# EasyEDA Pro project ProDoc_AstrAlim_2025-03-20.epro, board AstrAlim PCB
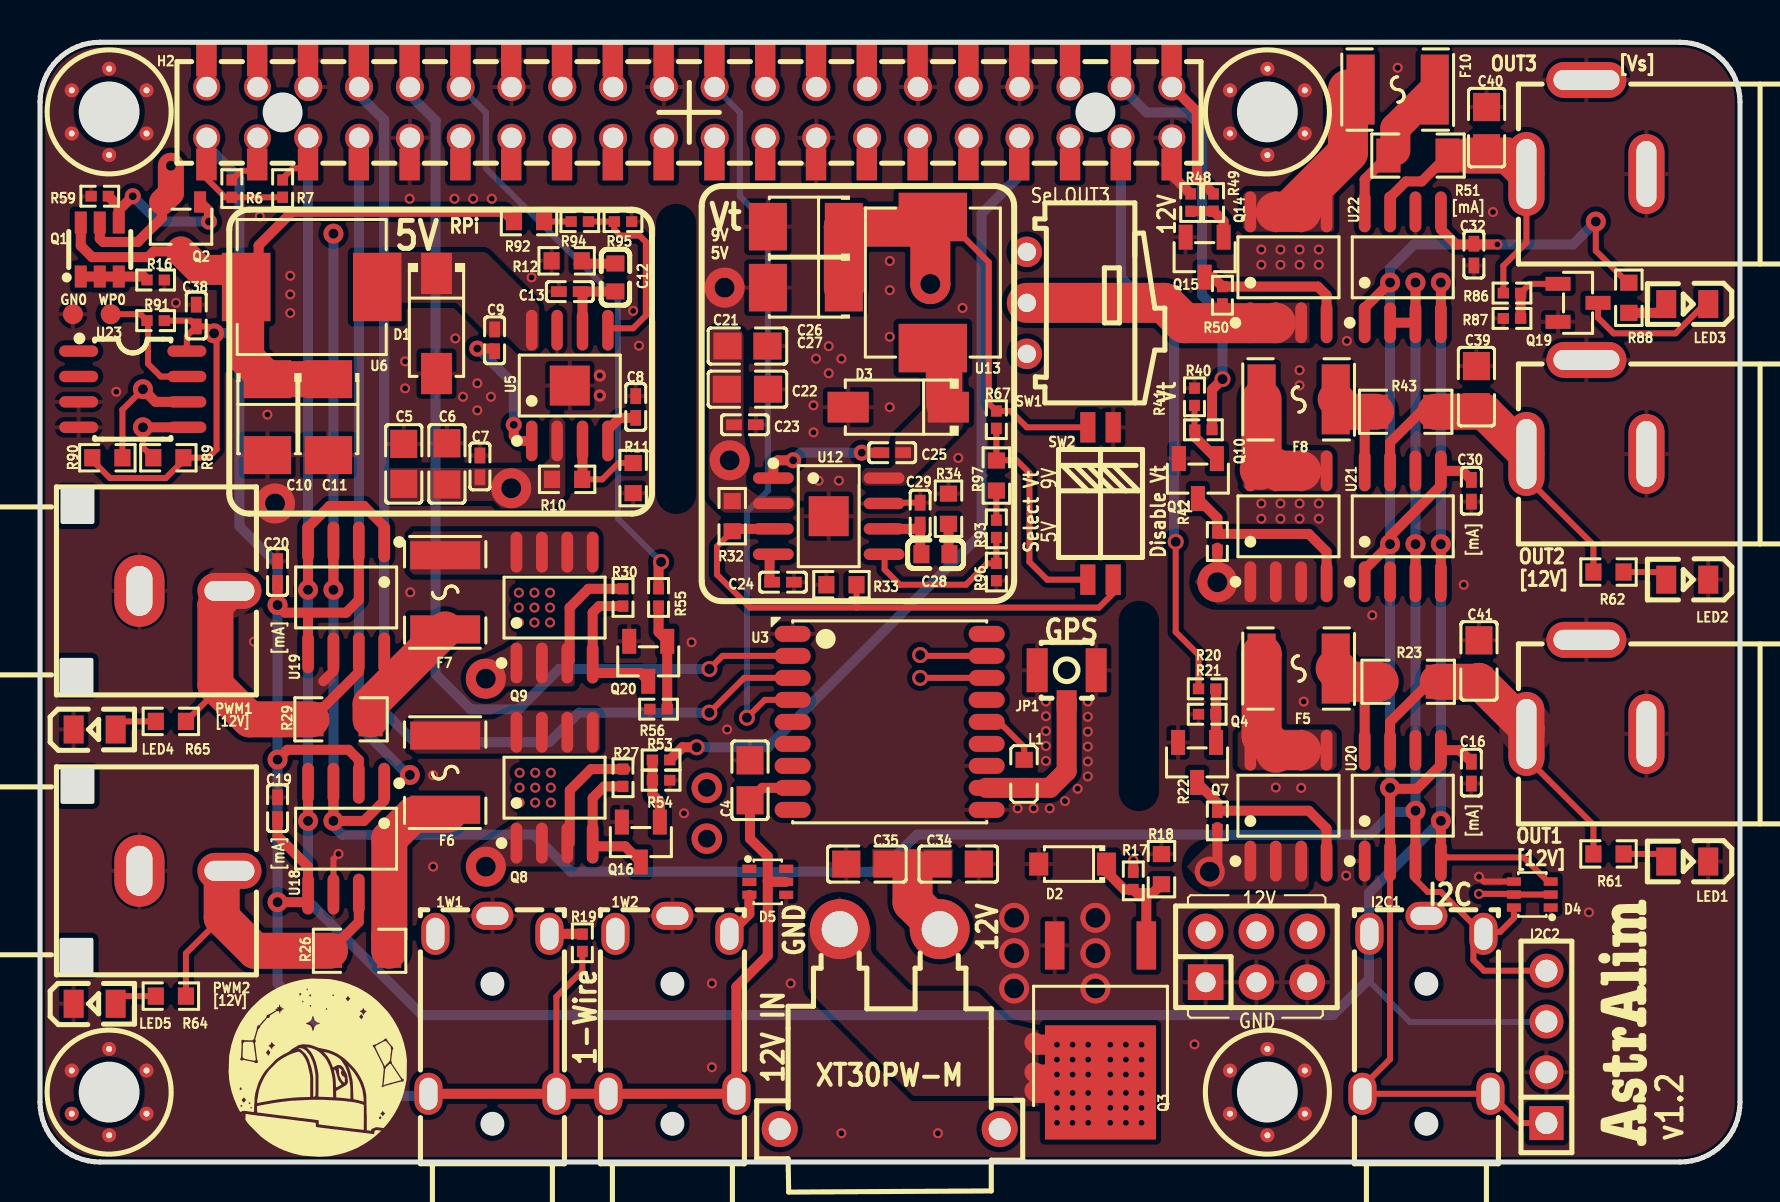
[diagram p2: board, top side]
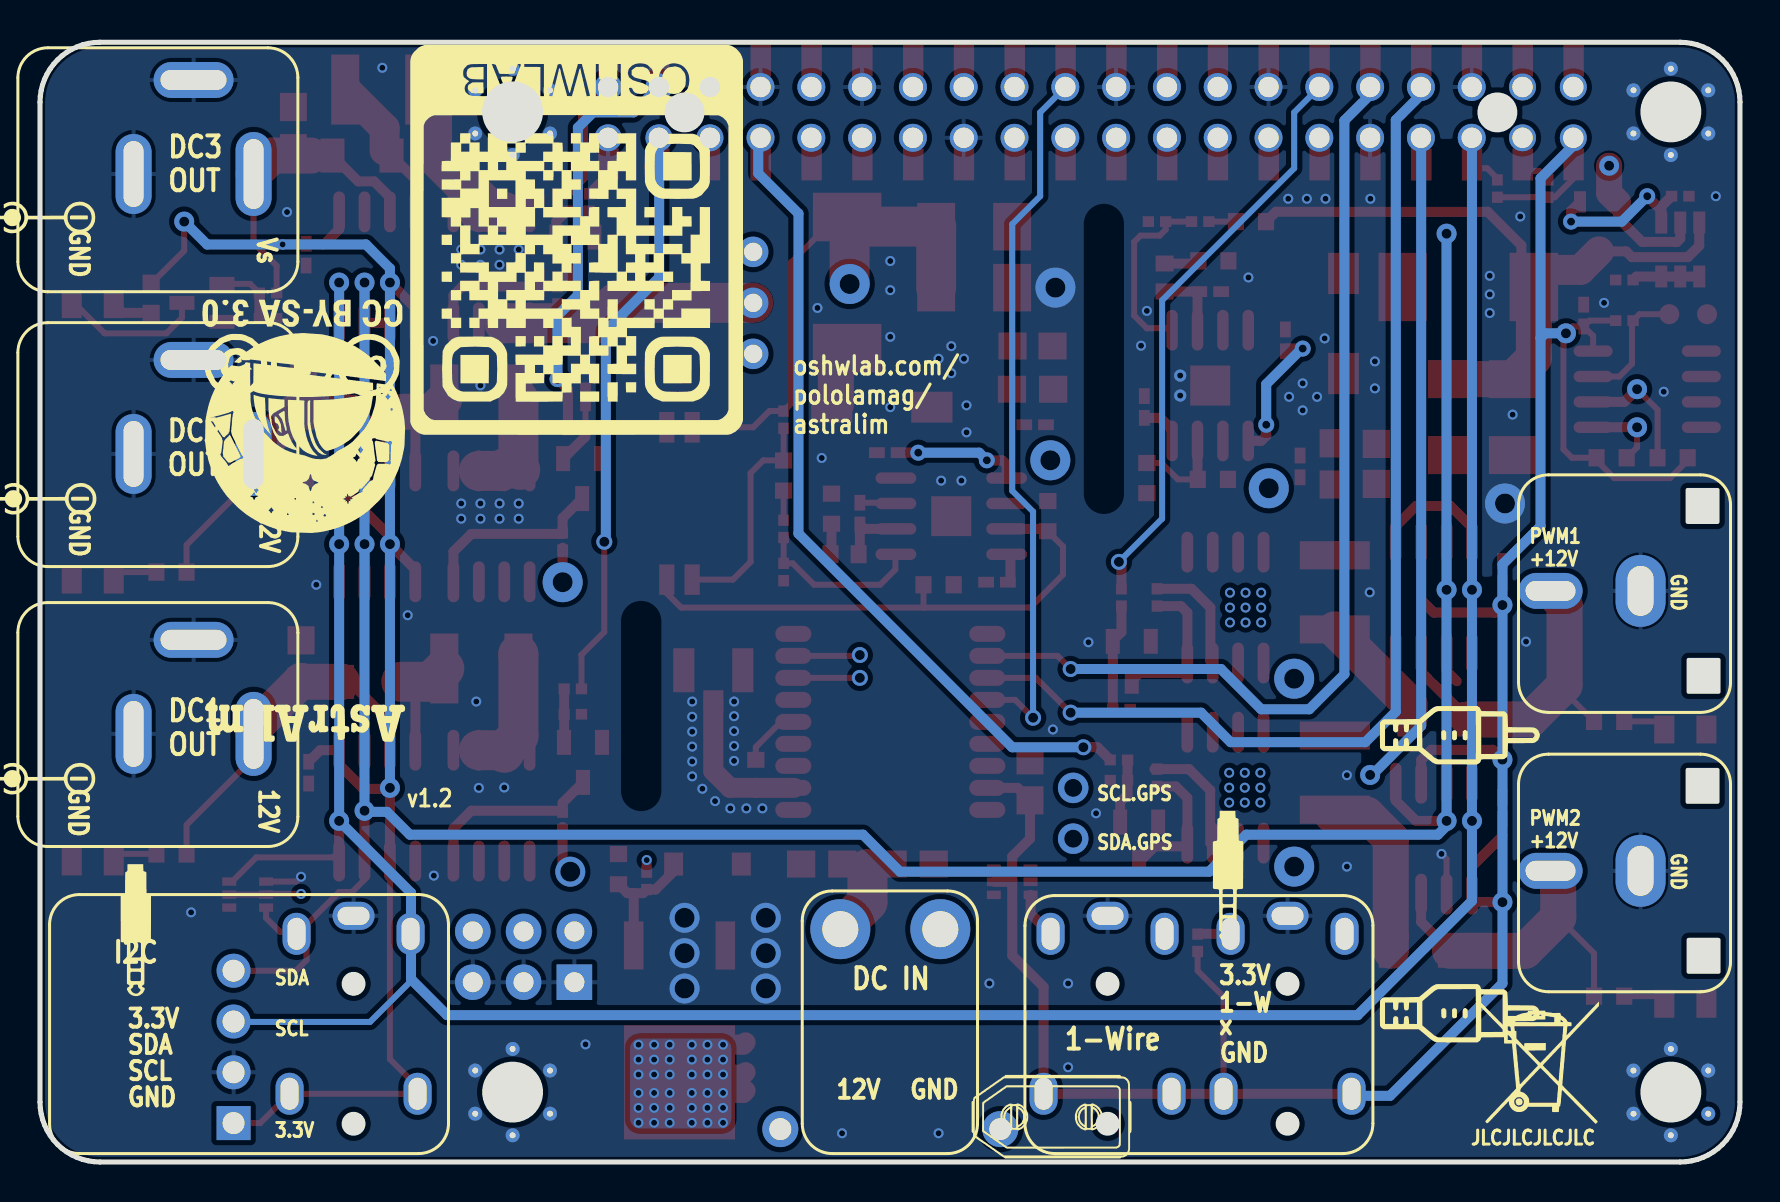
[diagram p3: board, bottom side, seen from below]

Outline 85 x 56 mm; copper layers: Top Layer, Inner1, Inner2, Bottom Layer. Coordinates in mm from the lower left corner of the outline.
Stack: Top Layer 0.035mm 外层铜厚1oz / Dielectric1 0.2104mm 7628 RC49% 8.6mil / Inner1 0.0152mm 内层铜厚 / Dielectric2 1.065mm 1.1mm H/HOZ 含铜 / Inner2 0.0152mm 内层铜厚 / Dielectric3 0.2104mm 7628 RC49% 8.6mil / Bottom Layer 0.035mm 外层铜厚1oz

## Design rules (mm)
template: Custom Config
spacing copperThickness1oz (default): track to track 0.102, other pairs 0.1 to 0.3
spacing copperThickness2oz: track to track 0.203, other pairs 0.152 to 0.3
spacing safeClearance1: track to track 0.152, other pairs 0.152 to 0.3
track width copperThickness1oz (default): min 0.3, default 0.5, max 6
track width copperThickness2oz: min 0.203, default 0.254, max 2.54
differential pair differentialPair (default): width min 0.127, default 0.254, max 2.54; gap min 0.152, default 0.152
via viaSize (default): diameter min 0.5, default 0.61, max 10; hole min 0.3, default 0.305, max 6.299

## Placement (name value [footprint] x y rotation side)
1W1  PJ-322环保  [AUDIO-TH_HOOYA_PJ-322]  22.62 7.86 90 top
1W2  PJ-322环保  [AUDIO-TH_HOOYA_PJ-322]  31.62 7.86 90 top
C4  10uF  [C0805#2]  35.5 19.09 90 top
C5  10uF  [C0805#2]  18.19 34.91 270 top
C6  4.7uF  [C0805]  20.35 34.91 270 top
C7  10nF  [C0402]  22 34.79 270 top
C8  10nF  [C0402]  29.78 37.76 270 top
C9  10nF  [C0402]  22.73 41.09 90 top
C10  47uF  [CAP-SMD_L3.5-W2.8-R-RD]  11.37 37.25 90 top
C11  47uF  [CAP-SMD_L3.5-W2.8-R-RD]  14.42 37.25 90 top
C12  2.2nF  [C0603]  28.77 44.24 270 top
C13  22pF  [C0402]  26.49 43.53 0 top
C16  100nF  [C0402]  71.57 19.47 270 top
C19  100nF  [C0402]  11.88 17.69 90 top
C20  100nF  [C0402]  11.88 29.5 90 top
C21  10uF  [C0805#2]  35.37 40.81 180 top
C22  4.7uF  [C0805]  35.37 38.65 180 top
C23  10nF  [C0402]  35.25 36.87 180 top
C24  10nF  [C0402]  37.15 29 180 top
C25  10nF  [C0402]  42.61 35.47 0 top
C26  47uF  [CAP-SMD_L3.5-W2.8-R-RD]  38.29 46.78 0 top
C27  47uF  [CAP-SMD_L3.5-W2.8-R-RD]  38.29 43.73 0 top
C28  2.2nF  [C0603]  44.77 30.39 180 top
C29  22pF  [C0402]  44.01 32.43 270 top
C30  100nF  [C0402]  71.57 33.57 270 top
C32  100nF  [C0402]  71.69 45.38 270 top
C34  22uF  [C0805]  45.91 14.9 180 top
C35  22uF  [C0805]  41.34 14.9 0 top
C38  100nF  [C0402]  7.81 42.33 270 top
C39  22uF  [C0805]  71.82 38.78 270 top
C40  22uF  [C0805]  72.33 51.73 270 top
C41  22uF  [C0805]  71.95 25.06 270 top
CN5  PM254-2-03-Z-8.5  [HDR-TH_6P-P2.54-V-F-R2-C3-S2.54]  60.82 10.26 0 top
D1  SS54  [SMA_L4.4-W2.8-LS5.4-R-RD]  19.83 41.94 270 top
D2  MM1Z15  [SOD-123_L2.7-W1.6-LS3.6-RD]  51.63 14.9 180 top
D3  SS54  [SMA_L4.4-W2.8-LS5.4-R-RD]  42.91 37.75 180 top
D4  BAV99S,115  [SOT-363_L2.0-W1.3-P0.65-LS2.1-TL]  74.62 13.38 180 top
D5  BAV99S,115  [SOT-363_L2.0-W1.3-P0.65-LS2.1-TL]  36.39 14.01 0 top
DC0  XT30PW-M  [CONN-TH_XT30PW-M]  42.48 6.64 0 top
DC1  DC-005-5A-2.0  [DC-IN-TH_DC-005-5A-2.0]  77.32 23.76 180 top
DC2  DC-005-5A-2.0  [DC-IN-TH_DC-005-5A-2.0]  77.32 37.76 180 top
DC3  DC-005-5A-2.0  [DC-IN-TH_DC-005-5A-2.0]  77.32 51.76 180 top
F5  1812L300/16GR  [F1812]  62.93 24.68 180 top
F6  1812L300/16GR  [F1812]  20.26 19.47 90 top
F7  1812L300/16GR  [F1812]  20.26 28.49 90 top
F8  1812L300/16GR  [F1812]  62.93 38.14 180 top
F10  1812L300/16GR  [F1812]  67.88 53.64 180 top
GN0  -  [test-point-0.5mm]  1.65 42.4 180 top
H2  FH-00369  [CONN-SMD_FH-00369]  32.45 52.49 0 top
I2C1  PJ-322环保  [AUDIO-TH_HOOYA_PJ-322]  69.32 7.86 90 top
I2C2  2.54-1*4P  [HDR-TH_4P-P2.54-V-F]  75.32 5.76 90 top
JP1  BWU.FL-IPEX1  [IPEX-SMD_BWIPX-1-001E]  51.33 23.83 90 top
L1  47nH  [IND-SMD_L1.6-W0.8-1]  49.21 19.41 90 top
LED1  NCD0805R1  [LED0805-R-RD]  82.36 15.03 180 top
LED2  NCD0805R1  [LED0805-R-RD]  82.36 29.12 180 top
LED3  NCD0805R1  [LED0805-R-RD]  82.36 42.91 180 top
LED4  NCD0805R1  [LED0805-R-RD]  2.73 21.63 0 top
LED5  NCD0805R1  [LED0805-R-RD]  2.73 7.92 0 top
PWM1  AV-5  [RCJ-04]  6.92 28.56 270 top
PWM2  AV-5  [RCJ-04]  6.92 14.56 270 top
Q1  DMMT5401-7-F  [SOT-23-6_L2.9-W1.6-P0.95-LS2.8-BR]  2.99 45.63 270 top
Q2  AP2317A  [SOT-23-3_L2.9-W1.6-P1.90-LS2.8-BR]  7.05 46.78 90 top
Q3  DMTH4004LK3-13  [TO-252-2_L6.6-W6.1-P4.58-LS9.9-TL]  53.03 7.41 270 top
Q4  NCE30P12S  [SOIC-8_L4.9-W3.9-P1.27-LS6.0-BL]  62.42 17.82 0 top
Q7  MMBT3904  [SOT-23-3_L2.9-W1.3-P1.90-LS2.4-BR]  57.85 19.98 90 top
Q8  NCE30P12S  [SOIC-8_L4.9-W3.9-P1.27-LS6.0-BL]  25.73 18.72 0 top
Q9  NCE30P12S  [SOIC-8_L4.9-W3.9-P1.27-LS6.0-BL]  25.73 27.73 0 top
Q10  NCE30P12S  [SOIC-8_L4.9-W3.9-P1.27-LS6.0-BL]  62.42 31.79 0 top
Q11  MMBT3904  [SOT-23-3_L2.9-W1.3-P1.90-LS2.4-BR]  57.89 34.18 90 top
Q14  NCE30P12S  [SOIC-8_L4.9-W3.9-P1.27-LS6.0-BL]  62.42 44.75 0 top
Q15  MMBT3904  [SOT-23-3_L2.9-W1.3-P1.90-LS2.4-BR]  58.23 45.25 90 top
Q16  MMBT3904  [SOT-23-3_L2.9-W1.3-P1.90-LS2.4-BR]  30.04 16 90 top
Q19  MMBT3904  [SOT-23-3_L2.9-W1.3-P1.90-LS2.4-BR]  76.9 42.97 180 top
Q20  MMBT3904  [SOT-23-3_L2.9-W1.3-P1.90-LS2.4-BR]  30.41 25.04 90 top
R6  10kΩ  [R0402]  9.59 48.68 270 top
R7  10kΩ  [R0402]  12.13 48.68 270 top
R10  665kΩ  [R0603]  26.36 34.14 180 top
R11  130kΩ  [R0603]  29.66 34.2 90 top
R12  39kΩ  [R0603]  26.33 45.07 180 top
R16  10kΩ  [R0402]  5.78 44.11 180 top
R17  1kΩ  [R0402]  54.66 14.06 270 top
R18  470kΩ  [R0603]  56.07 14.65 270 top
R19  4.7kΩ  [R0402]  27.12 10.96 270 top
R20  10kΩ  [R0402]  58.36 22.39 0 top
R21  1kΩ  [R0402]  58.36 23.66 0 top
R22  1kΩ  [R0402]  58.87 17.06 270 top
R23  10mΩ  [R1206]  68.41 24.02 180 top
R26  10mΩ  [R1206]  15.98 10.56 0 top
R27  1kΩ  [R0402]  29.15 19.22 90 top
R29  10mΩ  [R1206]  15.05 22.14 0 top
R30  1kΩ  [R0402]  29.15 28.23 90 top
R32  665kΩ  [R0603]  34.61 32.3 90 top
R33  82kΩ  [R0603]  40.07 28.87 0 top
R34  39kΩ  [R0603]  45.43 32.67 90 top
R40  10kΩ  [R0402]  57.72 38.27 270 top
R41  1kΩ  [R0402]  58.17 36.62 180 top
R42  1kΩ  [R0402]  58.87 31.03 270 top
R43  10mΩ  [R1206]  68.28 37.52 180 top
R48  10kΩ  [R0402]  57.53 47.98 270 top
R49  1kΩ  [R0402]  58.68 47.98 270 top
R50  1kΩ  [R0402]  59.12 43.35 270 top
R51  10mΩ  [R1206]  68.9 50.33 180 top
R53  1kΩ  [R0402]  31.05 20.11 180 top
R54  10kΩ  [R0402]  31.05 19.09 180 top
R55  1kΩ  [R0402]  30.93 28.23 270 top
R56  10kΩ  [R0402]  30.93 22.65 0 top
R59  47kΩ  [R0402]  2.99 48.3 0 top
R61  5.1kΩ  [R0603]  78.43 15.41 0 top
R62  5.1kΩ  [R0603]  78.43 29.5 0 top
R64  5.1kΩ  [R0603]  6.54 8.3 180 top
R65  5.1kΩ  [R0603]  6.54 22.04 180 top
R67  10kΩ  [R0402]  47.82 37.12 90 top
R86  10kΩ  [R0402]  73.6 43.46 180 top
R87  10kΩ  [R0402]  73.6 42.19 0 top
R88  680Ω  [R0603]  79.44 43.22 270 top
R89  3.9kΩ  [R0603]  6.42 35.22 0 top
R90  3.9kΩ  [R0603]  3.37 35.22 180 top
R91  1kΩ  [R0402]  5.78 42.08 0 top
R92  750Ω  [R0603]  24.45 47.03 180 top
R93  10kΩ  [R0402]  47.82 31.66 270 top
R94  10kΩ  [R0402]  26.99 47.03 0 top
R95  2kΩ  [R0402]  29.15 47.03 180 top
R96  2kΩ  [R0402]  47.82 29.5 90 top
R97  470Ω  [R0603]  47.82 34.33 90 top
SW1  K3-1204D-L  [SW-TH_K3-1204D-L]  49.34 42.97 90 top
SW2  DSHP02TSGER  [SW-SMD_DSHP02TSGER]  53.03 32.93 180 top
U3  ATGM336H-6N-74  [COMM-SMD_18P-L10.1-W9.7-P1.1-TL_L76-LB]  42.48 22.01 0 top
U5  TPS54531DDAR  [SOIC-8_L5.0-W4.0-P1.27-LS6.0-BL-EP2.0]  26.49 38.83 0 top
U6  4.7uH  [IND-SMD_L7.3-W6.6]  13.59 43.76 0 top
U12  TPS54531DDAR  [SOIC-8_L5.0-W4.0-P1.27-LS6.0-BL-EP2.0]  39.44 32.3 270 top
U13  4.7uH  [IND-SMD_L7.3-W6.6]  44.64 43.98 270 top
U18  INA219AIDR  [SOIC-8_L4.9-W3.9-P1.27-LS6.0-BL]  15.31 16.17 180 top
U19  INA219AIDR  [SOIC-8_L4.9-W3.9-P1.27-LS6.0-BL]  15.31 28.23 180 top
U20  INA219AIDR  [SOIC-8_L4.9-W3.9-P1.27-LS6.0-BL]  68.14 17.82 0 top
U21  INA219AIDR  [SOIC-8_L4.9-W3.9-P1.27-LS6.0-BL]  68.14 31.79 0 top
U22  INA219AIDR  [SOIC-8_L4.9-W3.9-P1.27-LS6.0-BL]  68.14 44.75 0 top
U23  AT24C32D-SSHM-T  [SOIC-8_L5.0-W4.0-P1.27-LS6.0-BL]  4.64 38.65 270 top
WP0  -  [test-point-0.5mm]  3.54 42.4 180 top

## Footprints (pads in the part's own frame, mm; a bottom-side part is the same pattern mirrored in y, then rotated)
AUDIO-TH_HOOYA_PJ-322
  oval 1.4x2.1 hole 0.9x1.6: 1(4.45,0)
  oval 2.1x1.4 hole 1.6x0.9: 2(3.55,2.85) 3(-4.45,3.2) 3(-4.45,-3.2) 4(3.55,-2.85)
C0402
  rect 0.79x0.54 smd: 1(-0.545,0) 2(0.545,0)
C0603
  rect 0.8x0.9 smd: 1(-0.7,0) 2(0.7,0)
C0805
  rect 1.41x1.35 smd: 1(-1.03,0) 2(1.03,0)
C0805#2
  rect 1.41x1.35 smd: 1(-1,0) 2(1,0)
CAP-SMD_L3.5-W2.8-R-RD
  rect 1.9x2.376 smd: 1(1.899,0) 2(-1.899,0)
COMM-SMD_18P-L10.1-W9.7-P1.1-TL_L76-LB
  custom 1.8x0.8 smd: 1(-4.85,4.4) 2(-4.85,3.3) 3(-4.85,2.2) 4(-4.85,1.1) 5(-4.85,0) 6(-4.85,-1.1) 7(-4.85,-2.2) 8(-4.85,-3.3) 9(-4.85,-4.4) 10(4.85,-4.4) 11(4.85,-3.3) 12(4.85,-2.2) 13(4.85,-1.1) 14(4.85,0) 15(4.85,1.1) 16(4.85,2.2) 17(4.85,3.3) 18(4.85,4.4)
CONN-SMD_FH-00369
  rect 1.02x1.6 smd: 1(-24.13,-2.6) 2(-24.13,2.6) 3(-21.59,-2.6) 4(-21.59,2.6) 5(-19.05,-2.6) 6(-19.05,2.6) 7(-16.51,-2.6) 8(-16.51,2.6) 9(-13.97,-2.6) 10(-13.97,2.6) 11(-11.43,-2.6) 12(-11.43,2.6) 13(-8.89,-2.6) 14(-8.89,2.6) 15(-6.35,-2.6) 16(-6.35,2.6) 17(-3.81,-2.6) 18(-3.81,2.6) 19(-1.27,-2.6) 20(-1.27,2.6) 21(1.27,-2.6) 22(1.27,2.6) 23(3.81,-2.6) 24(3.81,2.6) 25(6.35,-2.6) 26(6.35,2.6) 27(8.89,-2.6) 28(8.89,2.6) 29(11.43,-2.6) 30(11.43,2.6) 31(13.97,-2.6) 32(13.97,2.6) 33(16.51,-2.6) 34(16.51,2.6) 35(19.05,-2.6) 36(19.05,2.6) 37(21.59,-2.6) 38(21.59,2.6) 39(24.13,-2.6) 40(24.13,2.6)
  round 1.35 hole 1.02: 1(-24.117,-1.27) 2(-24.117,1.27) 3(-21.578,-1.27) 4(-21.578,1.27) 35(19.05,-1.27) 36(19.05,1.27) 37(21.602,-1.27) 38(21.602,1.27) 39(24.142,-1.27) 40(24.142,1.27)
  round 1.4 hole 1.02: 5(-19.038,-1.27) 6(-19.038,1.27) 7(-16.497,-1.27) 8(-16.497,1.27) 9(-13.957,-1.27) 10(-13.957,1.27) 11(-11.418,-1.27) 12(-11.418,1.27) 13(-8.877,-1.27) 14(-8.877,1.27) 15(-6.338,-1.27) 16(-6.338,1.27) 17(-3.797,-1.27) 18(-3.797,1.27) 19(-1.258,-1.27) 20(-1.258,1.27) 21(1.282,-1.27) 22(1.282,1.27) 23(3.822,-1.27) 24(3.822,1.27) 25(6.362,-1.27) 26(6.362,1.27) 27(8.902,-1.27) 28(8.902,1.27) 29(11.443,-1.27) 30(11.443,1.27) 31(13.982,-1.27) 32(13.982,1.27) 33(16.523,-1.27) 34(16.523,1.27)
  round 0.7 hole 0.3: 42(-30.864,-1.054) 42(-30.864,-50.076) 42(27.048,-1.054) 42(27.048,-50.076) 44(-28.994,-2.134) 44(-28.994,-51.156) 44(28.918,-2.134) 44(28.918,-51.156) 46(-27.125,-1.054) 46(-27.125,-50.076) 46(30.788,-1.054) 46(30.788,-50.076) 48(-27.125,1.105) 48(-27.125,-47.917) 48(30.788,1.105) 48(30.788,-47.917) 50(-28.994,2.184) 50(-28.994,-46.837) 50(28.918,2.184) 50(28.918,-46.837) 52(-30.864,1.105) 52(-30.864,-47.917) 52(27.048,1.105) 52(27.048,-47.917)
CONN-TH_XT30PW-M
  round 3 hole 1.8: 1(-2.5,5) 2(2.5,5)
  round 1.8 hole 1.1: 3(5.5,-5) 4(-5.5,-5)
DC-IN-TH_DC-005-5A-2.0
  oval 1.8x4.2 hole 1x3.5: 1(3,2.352)
  oval 1.8x4 hole 1x3.3: 2(-3,2.352)
  oval 4x1.8 hole 3.3x1: 3(-0.001,-2.352)
F1812
  rect 1.407x3.499 smd: 1(-1.853,0) 2(1.853,0)
HDR-TH_4P-P2.54-V-F
  rect 1.7x1.7 hole 1.1: 1(-3.81,0)
  round 1.7 hole 1.1: 2(-1.27,0) 3(1.27,0) 4(3.81,0)
HDR-TH_6P-P2.54-V-F-R2-C3-S2.54
  rect 1.778x1.778 hole 1: 1(-2.54,-1.27)
  round 1.778 hole 1: 2(-2.54,1.27) 3(0,-1.27) 4(0,1.27) 5(2.54,-1.27) 6(2.54,1.27)
IND-SMD_L1.6-W0.8-1
  rect 0.8x0.864 smd: 1(0.7,0) 2(-0.7,0)
IND-SMD_L7.3-W6.6
  rect 2.424x3.42 smd: 1(3.278,0) 2(-3.278,0)
IPEX-SMD_BWIPX-1-001E
  rect 1.05x1 smd: 1(-0.762,0)
  rect 2.2x1.05 smd: 2(0.762,-1.475) 3(0.762,1.475)
LED0805-R-RD
  rect 1x1.399 smd: 1(1.05,0) 2(-1.05,0)
R0402
  rect 0.566x0.54 smd: 1(-0.433,0) 2(0.433,0)
R0603
  rect 0.806x0.864 smd: 1(-0.753,0) 2(0.753,0)
R1206
  rect 1.208x1.701 smd: 1(-1.479,0) 2(1.479,0)
RCJ-04
  oval 3.6x2.5 hole 2.5x1.3: 1(0,-1.95)
  oval 1.8x3.2 hole 1x2.5: 2(0,2.55)
SMA_L4.4-W2.8-LS5.4-R-RD
  rect 2.062x1.539 smd: 1(2.503,0) 2(-2.503,0)
SOD-123_L2.7-W1.6-LS3.6-RD
  rect 0.95x1.15 smd: 1(-1.692,0) 2(1.692,0)
SOIC-8_L4.9-W3.9-P1.27-LS6.0-BL
  oval 0.588x2.045 smd: 1(-1.905,-2.772) 2(-0.635,-2.772) 3(0.635,-2.772) 4(1.905,-2.772) 5(1.905,2.772) 6(0.635,2.772) 7(-0.635,2.772) 8(-1.905,2.772)
SOIC-8_L5.0-W4.0-P1.27-LS6.0-BL
  oval 0.569x1.95 smd: 1(-1.905,-2.705) 2(-0.635,-2.705) 3(0.635,-2.705) 4(1.905,-2.705) 5(1.905,2.705) 6(0.635,2.705) 7(-0.635,2.705) 8(-1.905,2.705)
SOIC-8_L5.0-W4.0-P1.27-LS6.0-BL-EP2.0
  oval 0.574x2.038 smd: 1(-1.905,-2.769) 2(-0.635,-2.769) 3(0.635,-2.769) 4(1.905,-2.769) 5(1.905,2.769) 6(0.635,2.769) 7(-0.635,2.769) 8(-1.905,2.769)
  rect 2x2 smd: 9(0,0)
SOT-23-3_L2.9-W1.3-P1.90-LS2.4-BR
  rect 1.25x0.7 smd: 1(1,-0.95) 2(1,0.95) 3(-1,0)
SOT-23-3_L2.9-W1.6-P1.90-LS2.8-BR
  rect 1.07x0.6 smd: 1(1.235,-0.95) 2(1.235,0.95) 3(-1.235,0)
SOT-23-6_L2.9-W1.6-P0.95-LS2.8-BR
  rect 1.1x0.6 smd: 1(1.35,-0.95) 2(1.35,0) 3(1.35,0.95) 4(-1.35,0.95) 5(-1.35,0) 6(-1.35,-0.95)
SOT-363_L2.0-W1.3-P0.65-LS2.1-TL
  rect 0.7x0.42 smd: 1(-0.92,0.65) 2(-0.92,0) 3(-0.92,-0.65) 4(0.92,-0.65) 5(0.92,0) 6(0.92,0.65)
SW-SMD_DSHP02TSGER
  rect 0.762x1.524 smd: 1(-0.635,-3.81) 2(0.635,-3.81) 3(0.635,3.81) 4(-0.635,3.81)
SW-TH_K3-1204D-L
  round 1.524 hole 0.914: 1(-2.55,0) 2(0,0) 3(2.55,0)
test-point-0.5mm
  round 1 smd: 1(0,0)
TO-252-2_L6.6-W6.1-P4.58-LS9.9-TL
  rect 2.409x0.979 smd: 1(-3.424,2.29) 3(-3.424,-2.29)
  rect 5.711x5.548 smd: 2(3.424,0)

## Nets
As in the schematic, except:
1-WIRE: 1W1.4 1W2.4 D5.3 H2.7 R19.1

Pads without a net: 1W1 2; 1W2 2; D5 1 2 6; DC0 3 4; H2 11 13 15 16 18 19 21 23 24 26 29 31 32 35 36; U3 5 6 7 9 13 15 18; U23 1 2

## Via types
v1: diameter 1, hole 0.5, Top Layer to Bottom Layer, 23 vias
v2: diameter 0.5, hole 0.3, Top Layer to Bottom Layer, 152 vias
v3: diameter 1.5, hole 1, Top Layer to Bottom Layer, 7 vias
v4: diameter 0.61, hole 0.305, Top Layer to Bottom Layer, 2 vias
v5: diameter 2, hole 1, Top Layer to Bottom Layer, 8 vias
v6: diameter 0.8, hole 0.5, Top Layer to Bottom Layer, 9 vias
v7: diameter 0.8, hole 0.4, Top Layer to Bottom Layer, 6 vias
v8: diameter 1.524, hole 0.9, Top Layer to Bottom Layer, 2 vias

## Routing (per net, layer and track width the routed paths; a pad name or vN(x,y) marks a point on that pad's centre or on a via; arc(x,y) is an arc through that point)
+3.3V: length 314.1
  Top Layer w0.3: 1W1.3 25.82,8.27 27.12,9.57 R19.2 ; C38.2 7.34,41.32 U23.8 ; C38.2 8.36,41.79 v1(8.7,41.44) 8.83,41.32 8.83,35.65 8.4,35.22 R89.2 7.17,35.08 6.29,34.2 3.5,34.2 2.62,35.08 R90.2 ; C38.2 7.52,42.08 R91.2 ; 8.07,49.79 8.07,49.44 9.26,48.25 R6.2 R7.2 ; U20.2 67.5,5.14 66.12,3.76 I2C1.3 I2C1.3 73.99,1.95 I2C2.1 ; R88.1 79.39,43.97 77.79,45.57 v1(77.79,47.03) ; D4.2 D4.5 73.66,13.41 v2(71.95,13.41)
  Top Layer w0.5: C19.1 11.88,16.3 13.4,14.77 U18.5 13.4,13 v1(11.88,13) ; 13.35,27.47 13.4,27.42 U19.5 ; 13.35,27.47 15.31,27.47 15.94,28.11 U19.2 ; 13.35,27.47 12.26,27.47 v1(11.88,27.85) C20.1 ; U18.2 15.94,20.11 15.43,20.61 12.37,20.61 v1(11.88,20.12) ; 36.39,14.06 36.39,10.33 34.82,8.76 1W2.3 1W2.3 1W1.3 1W1.3 ; 36.39,14.06 36.44,14.01 D5.5 ; 36.39,14.06 36.39,15.28 35.5,16.17 C4.1 36.12,18.71 37.67,18.71 ; C16.1 70.99,20.59 U20.5 70.04,19.86 68.84,18.66 67.55,18.66 v1(67.5,18.71) U20.2 ; C30.1 71.12,34.56 U21.5 70.04,33.83 67.5,31.3 v1(67.5,30.9) 66.23,29.63 U21.1 ; v2(72.87,45.89) 70.81,45.89 70.04,46.65 U22.5 ; v1(67.5,43.98) 66.23,42.71 U22.1
  Inner1 w0.3: 8.32,51.22 10.1,49.44 26.99,49.44 28.64,51.09 28.64,51.22
  Inner2 w0.3: v2(71.95,13.41) 69.25,13.41 67.5,15.15 v1(67.5,18.71)
  Inner2 w0.5: H2.17 29.98,52.55 29.98,54.31 30.69,55.03 57.09,55.03 57.85,54.27 57.85,48.4 59.09,47.16 65.71,47.16 67.5,45.37 v1(67.5,43.98)
  Bottom Layer w0.5: v1(8.7,41.44) 9.74,41.44 9.97,41.21 ; 9.97,41.21 9.97,31.79 11.88,29.89 v1(11.88,27.85) v1(11.88,20.12) v1(11.88,13) 11.88,8.93 17.5,3.31 19.32,3.31 1W1.3 ; 9.97,41.21 9.97,49.19 8.32,50.84 8.32,51.22 ; v1(67.5,18.71) v1(67.5,30.9) v1(67.5,43.98) 67.5,44.69 68.7,45.89 v2(72.87,45.89) 76.65,45.89 v1(77.79,47.03)
+5V_A: length 33.3
  Top Layer w0.5: R92.2 23.21,47.52 12.61,47.52 10.93,45.84 10.93,44.51 10.43,44.01 ; Q2.3 5.69,45.54 5.4,45.25 2.61,45.25 2.04,45.82 Q1.6
  Top Layer w1.5: 10.43,44.01 9.83,44.62 7.98,44.62 Q2.3
  Top Layer w1.8: 13.33,39.17 13.3,39.15 C10.1 10.31,40.21 10.31,43.76
+5V_PI: length 14.2
  Top Layer w0.5: Q1.5 2.99,46.18 3.15,46.02 4.89,46.02 6.1,47.22 Q2.2
  Top Layer w1.3: Q2.2 6.54,48.45 v1(6.54,49.83)
  Inner1 w1.1: 8.25,53.76 8.19,53.76 6.54,52.11 6.54,49.95
  Inner2 w0.5: 10.86,53.76 8.45,53.76
+12V: length 50.4
  Top Layer w0.5: R30.2 27.42,28.67 26.48,27.73 26.48,25.07 Q9.3 ; 29.28,19.65 27.55,19.65 26.49,18.59 26.49,15.95 ; v3(58.49,14.52) 58.87,14.9 58.87,16.75 ; 58.87,30.72 v5(58.87,29) ; v2(54.66,15.1) 54.66,14.49
  Top Layer w2: 43.63,14.65 43.63,13 DC0.2
  Inner2 w2: 63.39,11.53 CN5.4 58.31,11.53 57.98,11.86 57.98,14.01 v3(58.49,14.52) ; v5(58.87,29) 58.87,36.36 54.81,40.42 SW1.1
  Inner2 w4: DC0.2 45.02,11.69 45.02,14.98
  vias: v2(23.94,28.47) v2(23.94,27.73) v2(23.94,26.98) v2(23.98,19.47) v2(23.98,18.72) v2(23.98,17.97) v2(24.72,28.47) v2(24.72,27.73) v2(24.72,26.98) v2(24.76,19.47) v2(24.76,18.72) v2(24.76,17.97) v2(25.5,28.47) v2(25.5,27.73) v2(25.5,26.98) v2(25.54,19.47) v2(25.54,18.72) v2(25.54,17.97) v5(22.29,24.17) v5(22.29,14.77) v5(23.56,33.7) v5(34.48,35.09)
GND: length 9.3
  Top Layer w0.3: D4.4 72.19,14.03 v2(71.95,14.27) ; v2(14.93,15.41) 14.67,15.15 U18.6 ; C29.1 42.24,32.97 U12.7
  Top Layer w0.5: U19.6 14.67,24.55 14.16,24.04 ; R48.1 56.58,49.37 H2.39
  vias: v2(1.21,48.3) v2(3.81,38.52) v2(6.8,42.97) v2(10.7,26.02) v2(10.99,47.28) v2(11.37,37.38) v2(12.51,44.32) v2(12.51,43.39) v2(12.51,42.46) v2(18.26,40.04) v2(18.26,38.69) v2(18.48,48.17) v2(18.51,28.49) v2(19.66,19.34) v2(19.66,14.77) v2(20.73,48.17) v2(20.77,41.19) v2(21.15,38.27) v2(21.66,48.17) v2(21.87,38.94) v2(21.87,37.59) v2(22.55,38.27) v2(22.59,48.17) v2(24.58,44.24) v2(29.66,42.56) v2(29.95,40.82) v2(32.2,17.44) v2(32.58,25.99) v2(33.59,8.93) v2(33.59,4.74) v2(34.36,21.63) v2(37.53,8.93) v2(38.67,37.84) v2(38.67,36.49) v2(38.8,40.17) v2(38.93,34.08) v2(39.44,40.8) v2(39.44,39.45) v2(39.94,34.08) v2(40.07,40.17) v2(40.07,1.44) v2(42.49,45.06) v2(42.49,43.6) v2(42.49,41.27) v2(42.49,37.75) v2(44.9,1.44) v2(45.91,35.21) v2(46.13,42.71) v2(48.88,17.68) v2(49.68,17.68) v2(50.29,23.03) v2(50.3,22.3) v2(50.3,21.55) v2(50.3,20.81) v2(50.3,20.06) v2(50.49,17.68) v2(51.25,18.05) v2(51.88,18.67) v2(52.39,23.03) v2(52.39,22.27) v2(52.39,21.52) v2(52.39,20.78) v2(52.39,20.03) v2(52.39,19.29) v2(57.72,5.88) v2(61.07,45.63) v2(61.07,44.87) v2(61.07,32.93) v2(61.07,32.17) v2(61.79,18.73) v2(62.02,45.63) v2(62.02,44.87) v2(62.02,32.93) v2(62.02,32.17) v2(62.98,45.63) v2(62.98,44.87) v2(62.98,39.6) v2(62.98,38.84) v2(62.98,32.93) v2(62.98,32.17) v2(63.06,18.71) v2(63.19,23.03) v2(63.94,45.63) v2(63.94,44.87) v2(63.94,32.93) v2(63.94,32.17) v2(65.34,41.06) v2(65.31,14.32) v2(66.61,27.35) v2(67.88,54.72) v2(71.19,28.87) v2(72.65,47.51) v2(77.45,12.49) v3(48.71,12.21) v3(48.71,10.44) v3(48.71,8.68) v3(52.77,12.21) v3(52.77,10.44) v3(52.77,8.68) v4(27.99,39.33) v4(27.99,38.33) v5(11.75,32.93) v5(34.23,43.73)
GND_IN: length 8.3
  Top Layer w1: v2(50.85,4.38) 49.84,4.38 49.72,4.49 ; v2(50.85,3.45) 49.84,3.45 49.72,3.57 ; 49.72,5.98 49.84,5.87 v2(50.85,5.87)
  Inner2 w1: v2(50.85,4.38) 49.85,4.38 49.72,4.5 ; v2(50.85,5.87) 49.85,5.87 49.72,5.99 ; 49.72,3.58 49.85,3.45 v2(50.85,3.45) ; 49.98,2.09 50.1,1.96 v2(50.85,1.96) 50.98,1.96 51.1,2.09
  vias: v2(50.85,5.12) v2(50.85,2.71) v2(51.63,5.87) v2(51.63,5.12) v2(51.63,4.38) v2(51.63,3.45) v2(51.63,2.71) v2(51.63,1.96) v2(52.41,5.87) v2(52.41,5.12) v2(52.41,4.38) v2(52.41,3.45) v2(52.41,2.71) v2(52.41,1.96) v2(53.52,5.87) v2(53.52,5.12) v2(53.52,4.38) v2(53.52,3.45) v2(53.52,2.71) v2(53.52,1.96) v2(54.3,5.87) v2(54.3,5.12) v2(54.3,4.38) v2(54.3,3.45) v2(54.3,2.71) v2(54.3,1.96) v2(55.08,5.87) v2(55.08,5.12) v2(55.08,4.38) v2(55.08,3.45) v2(55.08,2.71) v2(55.08,1.96)
1-WIRE: length 65.8
  Top Layer w0.5: 1W1.4 27.1,11.41 R19.1 ; 35.47,13.36 35.47,12.41 1W2.4
  Inner2 w0.5: 34.41,11.59 33.91,11.09 31.18,11.09 29.53,9.44 27.68,9.44 25.52,11.59 ; 25.02,11.09 22.42,11.09 20.64,9.31 18.74,9.31 17.21,10.84 17.21,18.08 v1(18.49,19.36)
  Bottom Layer w0.5: 18.42,19.33 15.94,21.81 15.94,51.22
EN_ALIM: length 27.2
  Top Layer w0.3: R32.1 33.85,30.78 33.85,29.38 35.5,27.73 40.83,27.73 ; R33.2 40.83,27.73 40.83,27.73 ; 40.83,27.73 52.94,27.73 53.66,28.45 SW2.4
  Top Layer w0.5: R32.1 34.73,31.66 U12.3
FB: length 11.3
  Top Layer w0.3: 52.39,29.12 50.36,29.12 49.47,30.01 49.47,34.46 48.83,35.09 47.83,35.09 R97.2 R67.1
GPIO13_PWM1: length 41
  Top Layer w0.5: R53.1 32.12,20.74 v6(32.83,20.74)
  Bottom Layer w0.5: v6(32.83,20.74) 36.39,20.74 47.08,31.43 47.08,47.43 49.09,49.44 49.09,51.29
GPIO18_PWM0: length 29.3
  Top Layer w0.5: R55.1 30.93,29.89 v6(31.05,30.01)
  Bottom Layer w0.3: 21.02,53.76 22.29,52.49 22.29,49.7 28.9,43.09 28.9,32.17 v6(31.05,30.01)
GPIO20: length 20.6
  Top Layer w0.5: R41.1 58.6,38.63 v6(59.13,39.15)
  Bottom Layer w0.5: v6(59.13,39.15) 59.13,42.33 58.11,43.35 58.11,51.73 57.34,52.49 55.32,52.49 H2.38
GPIO21: length 6.2
  Top Layer w0.5: 56.64,53.74 57.85,52.54 57.85,49.25 R49.1
GPIO26: length 29.2
  Top Layer w0.3: v6(56.79,31.02) 56.79,26.51 57.94,25.36 57.93,25.35 57.93,23.66
  Bottom Layer w0.5: 54.04,51.22 54.04,44.24 56.71,41.57 56.71,31.09 v6(56.79,31.02)
ID_SC: length 52.8
  Top Layer w0.3: R90.1 4.12,37.62 v1(5.15,38.65)
  Top Layer w0.5: U23.6 5.78,38.01 v1(5.15,38.65)
  Inner2 w0.3: v1(5.15,38.65) 11.37,38.65 16.7,43.98 16.7,48.05 18.1,49.44 39.56,49.44 40.07,49.95 40.07,52.82 41.01,53.76 41.34,53.76
ID_SD: length 50.6
  Top Layer w0.3: R89.1 5.15,35.74 v1(5.15,36.74) ; 41.34,51.22 41.09,50.97 41.09,49.79
  Top Layer w0.5: v1(5.15,36.74) U23.5
  Inner2 w0.3: v1(5.15,36.74) 12.39,36.74 18.35,42.71 18.35,46.9 20.39,48.94 39.94,48.94 41.09,50.08 41.09,50.97 41.34,51.22
PPS: length 35.8
  Top Layer w0.3: 37.67,23.11 36.24,23.11 v6(35.35,22.22)
  Bottom Layer w0.3: v6(35.35,22.22) 35.35,32.53 36.39,33.57 36.39,46.9 34.99,48.3 34.99,52.49 33.72,53.76
RXD: length 49.6
  Top Layer w0.3: v6(33.47,24.66) 34.12,25.31 37.67,25.31
  Bottom Layer w0.5: v6(33.47,24.66) 25.95,24.66 23.94,22.64 21.53,22.64 19.78,24.4 19.78,52.08 18.48,53.38 18.48,53.76
SCL: length 165.5
  Top Layer w0.3: 12.13,49.11 12.13,49.19 12.64,49.7 13.21,49.7 H2.5 13.4,51.22 ; D4.3 75.4,14.03 74.19,15.23 70.34,15.23 70.04,15.53
  Top Layer w0.5: v1(13.4,28.62) U19.4 13.4,31.74 14.47,32.81 16.2,32.81 17.21,31.79 U19.1 ; v1(70.04,30.9) U21.4 ; v1(13.4,17.06) U18.4 ; U20.4 v1(70.04,17.06) ; v1(70.04,43.98) U22.4
  Bottom Layer w0.3: 66.4,9.1 68.5,7.01 74.88,7.01 74.9,7.03
  Bottom Layer w0.5: 13.4,51.22 v1(13.4,28.62) v1(13.4,17.06) 13.4,13.06 19.11,7.35 64.65,7.35 66.45,9.15 66.45,13.47 v1(70.04,17.06) v1(70.04,30.9) v1(70.04,43.98)
SCLG: length 16.7
  Top Layer w0.3: U3.17 44.01,25.31
  Inner1 w0.3: v8(33.34,18.71) 35.5,18.71 42.14,25.36 v6(44.01,25.36)
SDA: length 149.1
  Top Layer w0.3: 71.67,11.51 71.77,11.41 71.93,11.41 71.95,11.44 71.95,11.51 ; 71.67,11.51 71.67,10.1 72.2,9.57 74.9,9.57 ; 71.67,11.51 71.7,11.51 ; 71.7,11.51 71.7,11.85 70.04,13.5 69.39,13.5 68.77,14.12 U20.3 ; 71.7,11.51 71.95,11.51 ; D4.6 73.7,12.2 73.01,11.51 71.95,11.51 ; 9.59,49.11 10.05,49.57 10.54,49.57 H2.3
  Top Layer w0.5: v1(68.77,30.9) U21.3 ; v1(68.77,17.57) U20.3 ; U18.1 17.21,18.08 16.2,17.06 v1(14.67,17.06) U18.3 ; v1(68.77,43.98) U22.3 U22.2 ; v1(14.67,28.62) U19.3
  Inner2 w0.5: v1(14.67,46.43) 10.87,50.22 H2.3
  Bottom Layer w0.5: v1(68.77,43.98) v1(68.77,30.9) v1(68.77,17.57) ; v1(14.67,17.06) v1(14.67,28.62) v1(14.67,46.43) ; 14.67,16.81 15.11,16.37 24.69,16.37 26.54,14.52 42,14.52 43.85,16.37 66.51,16.37 67.65,17.51 68.57,17.51 68.77,17.31
SDAG: length 18.3
  Top Layer w0.3: U3.16 v6(44.01,24.21)
  Inner1 w0.3: v8(33.34,16.17) 37.66,16.17 44.01,22.52 v6(44.01,24.21)
TXD: length 54.2
  Top Layer w0.3: v6(33.47,22.47) 35.21,24.21 37.67,24.21
  Bottom Layer w0.5: 15.94,53.76 15.94,53.38 17.21,52.11 17.21,22.52 18.74,21 25.47,21 26.94,22.47 v6(33.47,22.47)
VS: length 12.9
  Top Layer w2: Q14.2 61.77,41.95 57.22,41.95 56.2,42.97 SW1.2
VT: length 33.7
  Top Layer w0.3: 45.36,46.49 45.94,46.49 47.44,45 47.44,37.94 R67.2 48.53,37.56 49.34,36.74 52.39,36.74
  Top Layer w2: C27.1 C26.1 44.16,46.78 ; v5(44.52,43.91) 44.52,47.13 U13.2
  Inner2 w2: SW1.3 47.61,47.25 45.88,47.25 44.52,45.89 v5(44.52,43.91)
$1N4635: length 4.8
  Top Layer w0.3: R10.1 28.11,34.14 28.93,34.96 R11.2
  Top Layer w0.5: U5.3 27.13,34.16 R10.1
$1N4659: length 2.2
  Top Layer w0.5: C8.2 28.99,37.22 28.4,36.62 U5.4
$1N4694: length 7
  Top Layer w0.5: v7(23.69,36.87) 23.69,36.32 23.94,36.06 U5.1 ; 21.91,40.68 22.6,40.68 C9.1
  Bottom Layer w0.5: 21.91,40.68 23.69,38.9 v7(23.69,36.87)
  vias: v7(21.87,40.68)
$1N5140: length 1.8
  Top Layer w0.5: C12.1 28.76,44.93 26.92,44.93
$1N5148: length 3.7
  Top Layer w0.5: U5.6 27.13,43.44 C13.2 28.76,43.53 28.77,43.54
$1N5310: length 9.4
  Top Layer w0.3: R94.2 R95.2 28.72,46.63 29.02,46.33 29.98,46.33 30.29,46.02 30.29,42.33 29.66,41.7 28.49,41.7 U5.5
$1N7006: length 8
  Top Layer w0.5: R59.2 3.94,47.78 3.94,47.6 ; v7(8.45,47.03) 8.45,47.56 Q2.1 ; 3.94,47.6 v7(4.64,48.3) ; 3.94,47.6 Q1.4
  Bottom Layer w0.5: v7(4.64,48.3) 5.91,47.03 v7(8.45,47.03)
$1N7063: length 3.4
  Top Layer w0.5: 5.35,44.11 5.17,44.28 Q1.3 Q1.2 Q1.1
$1N14594: length 1.5
  Top Layer w0.5: 36.48,29 36.48,30.2 U12.4
$1N14595: length 6.3
  Top Layer w0.5: U12.1 36.67,34.86 36.9,35.09 v7(37.66,35.09) ; v7(41.09,35.47) C25.1
  Bottom Layer w0.5: v7(41.09,35.47) 38.04,35.47 v7(37.66,35.09)
$1N14596: length 3.1
  Top Layer w1.8: U13.1 45.21,40.14 45.21,37.89
$1N14599: length 1.5
  Top Layer w0.5: C28.1 45.43,30.44 R34.1
$1N14601: length 3.4
  Top Layer w0.5: 44.07,30.39 44.01,30.46 C29.2 43.79,31.66 U12.6
$1N14603: length 8.4
  Top Layer w0.3: U12.5 42.23,30.37 42.23,29.63 42.99,28.87 46.29,28.87 47.36,29.94 R96.2 R93.2
$1N55959: length 6.4
  Top Layer w0.5: R18.2 55.63,13.45 55.32,13.45 ; Q3.1 55.32,13.45 ; 55.32,13.45 54.84,13.45 R17.2 54.22,13.63 53.32,14.53 D2.1
$1N62787: length 6.3
  Top Layer w0.3: U23.7 6.04,39.28 5.4,39.92 5.4,42.03 ; 5.35,42.08 5.03,42.4 WP0.1
$1N84327: length 3.1
  Top Layer w0.3: L1.1 49.21,20.75 47.95,22.01 47.3,22.01
$1N84331: length 7.9
  Top Layer w1: L1.2 50.5,18.71 51.33,19.55 JP1.1 ; 47.3,18.71 49.21,18.71
$1N99494: length 1.4
  Top Layer w0.3: R92.1 R94.1
$1N99682: length 1.5
  Top Layer w0.3: R97.1 R93.1
$2N529: length 2.7
  Top Layer w0.5: R21.2 R20.2 58.79,20.99 58.8,20.98
$2N530: length 9.3
  Top Layer w0.5: Q4.4 64.33,16.68 63.44,17.57 58.87,17.57 58.87,17.96 57.85,18.98
$2N536: length 6.2
  Top Layer w0.5: 65.45,24.02 66.23,23.23 U20.8
  Top Layer w2: F5.1 65.45,24.02 R23.2
$2N538: length 6.4
  Top Layer w2: 61.79,20.47 61.92,20.59 Q4.6 ; Q4.7 61.08,21.3 61.08,25.38 61.09,25.4
$2N1597: length 6.8
  Top Layer w0.5: R27.1 28.21,18.78 27.63,18.21 Q8.4 27.79,15.79 29.25,15.79 Q16.3
$2N1603: length 9
  Top Layer w1.8: 20.39,17.36 18.66,17.36 17.47,16.17 17.47,11.28 17.46,11.27 R26.2
$2N1610: length 7.6
  Top Layer w0.5: 30.42,24.06 30.03,24.45 27.72,24.45 27.63,24.54 Q9.4 27.63,27.48 27.95,27.8 R30.1
$2N1616: length 6
  Top Layer w1.8: F7.1 16.53,22.91 R29.2
$2N3421: length 3.1
  Top Layer w0.3: R40.2 57.72,36.63 R41.2
  Top Layer w0.5: Q11.1 58.83,35.18 57.8,36.21 57.74,36.27 R41.2
$2N3422: length 9.5
  Top Layer w0.5: Q10.4 64.33,30.52 63.44,31.41 58.87,31.41 58.87,32.2 Q11.3
$2N3428: length 5.2
  Top Layer w0.5: U21.8 66.23,37.51
  Top Layer w1.8: F8.1 65.41,37.52 66.8,37.52
$2N3430: length 4.9
  Top Layer w2: F8.2 61.08,34.7 60.99,34.61 ; 61.79,34.69 61.92,34.56 Q10.6
$2N4457: length 2.6
  Top Layer w0.5: R48.2 R49.2 59.18,47.05 Q15.1
$2N4458: length 7.8
  Top Layer w0.5: Q15.3 58.65,44.25 R50.1 63.9,43.78 64.33,43.35 Q14.4
$2N4464: length 7
  Top Layer w0.5: R51.2 66.23,49.14 U22.8
  Top Layer w1.5: 67.77,50.59 67.77,51.7 69.61,53.54
$2N4466: length 8.3
  Top Layer w2: Q14.7 Q14.6 ; 62.68,47.77 65.4,50.49 65.4,53.64
$2N24815: length 3.3
  Top Layer w0.5: R53.2 R54.2 30.62,18.38 30.99,18.01 Q16.1
$2N25317: length 5.3
  Top Layer w0.5: R55.2 30.93,26.5 31.37,26.06 31.36,26.05 R56.2
$2N39826: length 2.2
  Top Layer w0.3: R64.2 4.17,8.3 LED5.1
$2N39921: length 2.2
  Top Layer w0.3: R65.2 4.19,22.04 LED4.1
$2N39926: length 16.4
  Top Layer w0.3: R64.1 7.3,10.44 9.09,12.22
  Top Layer w0.5: R26.1 15.94,12 U18.7
  Top Layer w1.8: 9.09,14.45 9.09,12.22 10.75,10.56 R26.1
$2N39937: length 16.9
  Top Layer w0.3: R65.1 8.77,23.51
  Top Layer w0.5: U19.7 15.94,24.51 R29.1
  Top Layer w1.8: PWM1.2 8.77,27.86 8.77,23.85 10.48,22.14 R29.1
$2N40038: length 2.3
  Top Layer w0.3: R61.2 80.93,15.41 LED1.1
$2N40133: length 2.3
  Top Layer w0.3: R62.2 80.93,29.5 LED2.1
$2N40233: length 14.2
  Top Layer w0.3: R86.2 73.17,44.82 74.32,45.97 DC3.1
  Top Layer w0.5: U22.7 67.5,48.25 68.3,49.04 69.09,49.04 R51.1
  Top Layer w1.8: DC3.1 73.4,50.33 71.44,50.33
$2N40244: length 16.7
  Top Layer w0.3: R62.1 77.67,30.86 74.32,34.21 DC2.1
  Top Layer w0.5: 69.42,37.52 69.04,37.52 67.5,35.98 U21.7
  Top Layer w1.8: R43.1 72.21,37.52 DC2.1
$2N40255: length 17.4
  Top Layer w0.3: DC1.1 74.32,20.21 77.67,16.86 R61.1
  Top Layer w0.5: U20.7 67.5,22.01 69.51,24.02
  Top Layer w1.8: DC1.1 74.32,21.69 71.95,24.06 71.91,24.02 R23.1
$2N49861: length 3.3
  Top Layer w0.3: Q19.1 74.49,43.92 74.03,43.46
  Top Layer w0.5: 74.03,43.46 74.03,42.19
$2N57491: length 2.1
  Top Layer w0.5: LED3.1 80.88,42.47 R88.2
$2N90009: length 7.2
  Top Layer w0.3: Q19.3 77.9,42.22 78.68,41.44 81.77,41.44 83.23,42.91 LED3.2

## Copper pours and planes (outline as drawn; the poured copper is in the pictures)
+12V on Top Layer: 17.47,37.31 26.26,37.31 26.26,32.68 17.47,32.68
+12V on Top Layer: 21.52,26.08 26.74,26.08 26.74,23.35 21.52,23.35
+12V on Top Layer: 21.42,17.07 26.74,17.07 26.74,14.34 21.42,14.34
+12V on Top Layer: 33.43,41.69 37.79,41.69 37.79,32.47 33.43,32.47
+12V on Top Layer: 57.72,30.16 63.82,30.16 63.82,27.88 57.72,27.88
+12V on Top Layer: 41.6,15.66 45.66,15.66 45.66,14.28 41.6,14.28
+12V on Top Layer: 57.34,15.92 63.44,15.92 63.44,13.63 57.34,13.63
+12V on Inner2: 20.58,36.55 60.23,36.55 60.23,13.48 20.58,13.48
GND on Top Layer: -0.19,56.17 85.16,56.17 85.16,-0.09 -0.19,-0.09
GND on Bottom Layer: -0.19,56.17 85.18,56.17 85.18,-0.09 -0.19,-0.09
GND on Inner1: -0.19,56.17 85.16,56.17 85.16,-0.09 -0.19,-0.09
GND on Inner2: -0.19,56.17 85.16,56.17 85.16,-0.09 -0.19,-0.09
GND_IN on Top Layer: 38.41,13.25 49.93,13.25 49.93,2.8 38.41,2.8
GND_IN on Bottom Layer: 50.43,6.18 55.5,6.18 55.5,1.67 50.43,1.67
GND_IN on Inner2: 50.58,6.35 55.51,6.35 55.51,1.59 50.58,1.59
GND_IN on Inner2: 38.41,13.25 49.93,13.25 49.93,1.57 38.41,1.57
VS on Top Layer: 61.53,42.98 63.48,42.98 63.48,40.96 61.53,40.96
$1N4920 on Top Layer: 17.21,45.51 24.96,45.51 24.96,40.55 17.21,40.55
$1N14596 on Top Layer: 41.09,40.43 46.17,40.43 46.17,33.82 41.09,33.82
$2N538 on Top Layer: 59.88,21.63 64.84,21.63 64.84,19.6 59.88,19.6
$2N1605 on Top Layer: 18.61,22.58 28.01,22.58 28.01,20.42 18.61,20.42
$2N1618 on Top Layer: 18.48,31.54 27.88,31.54 27.88,29.38 18.48,29.38
$2N3430 on Top Layer: 60.14,35.6 64.58,35.6 64.58,33.57 60.14,33.57
$2N4466 on Top Layer: 60.14,48.56 64.71,48.56 64.71,46.52 60.14,46.52
$2N40233 on Top Layer: 69.84,51.19 72.58,51.19 72.58,49.48 69.84,49.48

## Text on the board
Bottom Silkscreen Layer: SDA | SCL | 3.3V | JLCJLCJLCJLC | SCL.GPS | SDA.GPS | GND | PWM1 / +12V | PWM2 / +12V | v1.2 | oshwlab.com/ / pololamag/ / astralim | 1-W | x | 12V | Vs | DC IN | DC3 / OUT | DC1 / OUT | DC2 / OUT | 1-Wire | I2C
Document Layer: 2 | Location ref. pin2 / from header Pi 40p: / => Center X = 52.5mm / => Center Y = -43.5mm
Top Silkscreen Layer: [12V] | [mA] | 9V / 5V | 9V | 5V | Sel.OUT3 | GND | 12V | Select Vt | Disable Vt | RPi | OUT3         [Vs] | OUT1 / [12V] | OUT2 / [12V] | Vt | GPS | 1-Wire | 12V IN | I2C | XT30PW-M | v1.2
